# Altium schematic sheet top.SchDoc
size A4; SheetNumber: 1; SheetTotal: 7
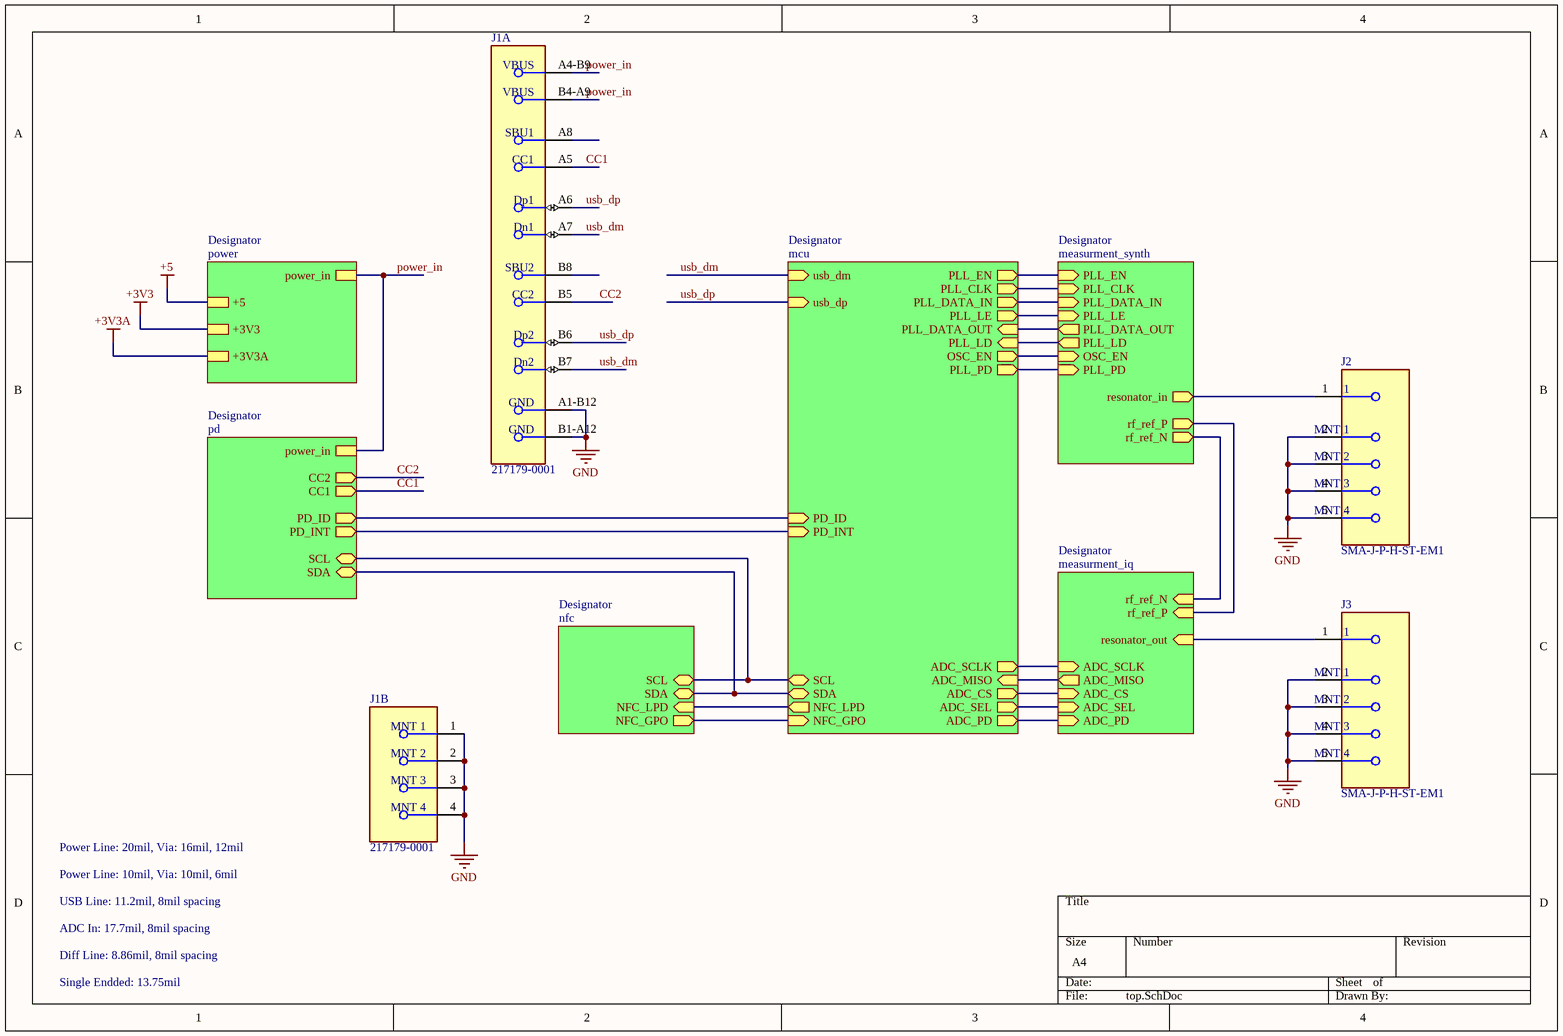
[diagram p0: top.SchDoc]

## Parts
J1  217179-0001  [FP-2171790001-MFG]  (parts A,B of 2)
J2  SMA-J-P-H-ST-EM1  [FP-SMA-J-P-H-ST-EM1-MFG]
J3  SMA-J-P-H-ST-EM1  [FP-SMA-J-P-H-ST-EM1-MFG]

## Sub-sheets
Designator = mcu: usb_dm (in), usb_dp (in), SCL (bidir), SDA (bidir), NFC_LPD (out), NFC_GPO (in), PLL_EN (out), PLL_CLK (out), PLL_DATA_IN (out), PLL_DATA_OUT (in), PLL_LD (in), OSC_EN (out), PLL_PD (out), PLL_LE (out), ADC_SEL (out), ADC_SCLK (out), ADC_MISO (in), ADC_CS (out), ADC_PD (out), PD_INT (in), PD_ID (in)
Designator = measurment_synth: PLL_EN (in), PLL_CLK (in), PLL_DATA_IN (in), PLL_LE (in), PLL_DATA_OUT (out), PLL_LD (out), OSC_EN (in), PLL_PD (in), resonator_in (out), rf_ref_P (out), rf_ref_N (out)
Designator = power: power_in, +3V3, +3V3A, +5
Designator = nfc: NFC_GPO (out), NFC_LPD (in), SCL (bidir), SDA (bidir)
Designator = measurment_iq: resonator_out (in), ADC_SEL (in), ADC_SCLK (in), ADC_MISO (out), ADC_CS (in), ADC_PD (in), rf_ref_P (in), rf_ref_N (in)
Designator = pd: CC1 (out), CC2 (out), SCL (bidir), SDA (bidir), power_in, PD_INT (out), PD_ID (out)

## Nets
+3V3: sheet Designator/+3V3
+3V3A: sheet Designator/+3V3A
+5: sheet Designator/+5
GND: J1.1(MNT_1) J1.2(MNT_2) J1.3(MNT_3) J1.4(MNT_4) J1.A1-B12(GND) J1.B1-A12(GND) J2.2(MNT_1) J2.3(MNT_2) J2.4(MNT_3) J2.5(MNT_4) J3.2(MNT_1) J3.3(MNT_2) J3.4(MNT_3) J3.5(MNT_4)
CC1: J1.A5(CC1) ; sheet Designator/CC1
CC2: J1.B5(CC2) ; sheet Designator/CC2
power_in: J1.A4-B9(VBUS) J1.B4-A9(VBUS) ; sheet Designator/power_in, sheet Designator/power_in
usb_dm: J1.A7(Dn1) J1.B7(Dn2) ; sheet Designator/usb_dm
usb_dp: J1.A6(Dp1) J1.B6(Dp2) ; sheet Designator/usb_dp
NetJ2_1: J2.1 ; sheet Designator/resonator_in
NetJ3_1: J3.1 ; sheet Designator/resonator_out
(unnamed): sheet Designator/SCL, sheet Designator/SCL, sheet Designator/SCL
(unnamed): sheet Designator/SDA, sheet Designator/SDA, sheet Designator/SDA
(unnamed): sheet Designator/NFC_LPD, sheet Designator/NFC_LPD
(unnamed): sheet Designator/NFC_GPO, sheet Designator/NFC_GPO
(unnamed): sheet Designator/PLL_EN, sheet Designator/PLL_EN
(unnamed): sheet Designator/PLL_CLK, sheet Designator/PLL_CLK
(unnamed): sheet Designator/PLL_DATA_IN, sheet Designator/PLL_DATA_IN
(unnamed): sheet Designator/PLL_DATA_OUT, sheet Designator/PLL_DATA_OUT
(unnamed): sheet Designator/PLL_LD, sheet Designator/PLL_LD
(unnamed): sheet Designator/OSC_EN, sheet Designator/OSC_EN
(unnamed): sheet Designator/PLL_PD, sheet Designator/PLL_PD
(unnamed): sheet Designator/PLL_LE, sheet Designator/PLL_LE
(unnamed): sheet Designator/ADC_SEL, sheet Designator/ADC_SEL
(unnamed): sheet Designator/ADC_SCLK, sheet Designator/ADC_SCLK
(unnamed): sheet Designator/ADC_MISO, sheet Designator/ADC_MISO
(unnamed): sheet Designator/ADC_CS, sheet Designator/ADC_CS
(unnamed): sheet Designator/ADC_PD, sheet Designator/ADC_PD
(unnamed): sheet Designator/PD_INT, sheet Designator/PD_INT
(unnamed): sheet Designator/PD_ID, sheet Designator/PD_ID
(unnamed): sheet Designator/rf_ref_P, sheet Designator/rf_ref_P
(unnamed): sheet Designator/rf_ref_N, sheet Designator/rf_ref_N

Not connected (* = marked no-connect by the designer): J1 A8(SBU1) B8(SBU2)

## Notes on the sheet
- Power Line: 20mil, Via: 16mil, 12mil
- Power Line: 10mil, Via: 10mil, 6mil
- USB Line: 11.2mil, 8mil spacing
- Diff Line: 8.86mil, 8mil spacing
- Single Endded: 13.75mil
- ADC In: 17.7mil, 8mil spacing

## Library data of the parts
J1 = CMP-04767-000028-2: CONN RCP USB2.0 TYP C 24P SMD RA; NexarPartId: 117190526; Gender: Receptacle; Number of Contacts: 16; Current Rating: 1.25A; Voltage Rating: 30V; Min Operating Temperature: -40°C; USB Standard: USB 2.0; Height: 3.36mm; Contact Material: Gold, Nickel; Max Operating Temperature: 85°C
J2 J3 = CMP-02754-000006-1: CONN SMA JACK STR 50OHM EDGE MNT; Dielectric Material: PTFE; Center Contact Plating: Gold; Max Frequency: 6GHz; Body Material: Brass; Voltage Rating: 335V; Impedance: 50R; Package Quantity: 1; Case/Package: SMA; Max Operating Temperature: 125°C; Fastening Type: Threaded; Orientation: Straight; Depth: 13.33mm; RoHS Compliant: Yes; Length: 6.35mm; Insulation Material: Polytetrafluoroethylene; Termination: Solder; Min Operating Temperature: -65°C; Housing Color: Gold; Contact Plating: Gold; Contact Material: Copper; Connector Type: SMA; Mount: Edge; Series: SMA; Packaging: Tray; Body Plating: Gold; Radiation Hardening: No